# EAGLE design LB_BIT_o16_LIGHTWIRE-v03(rev2) (EAGLE 6.6.0)
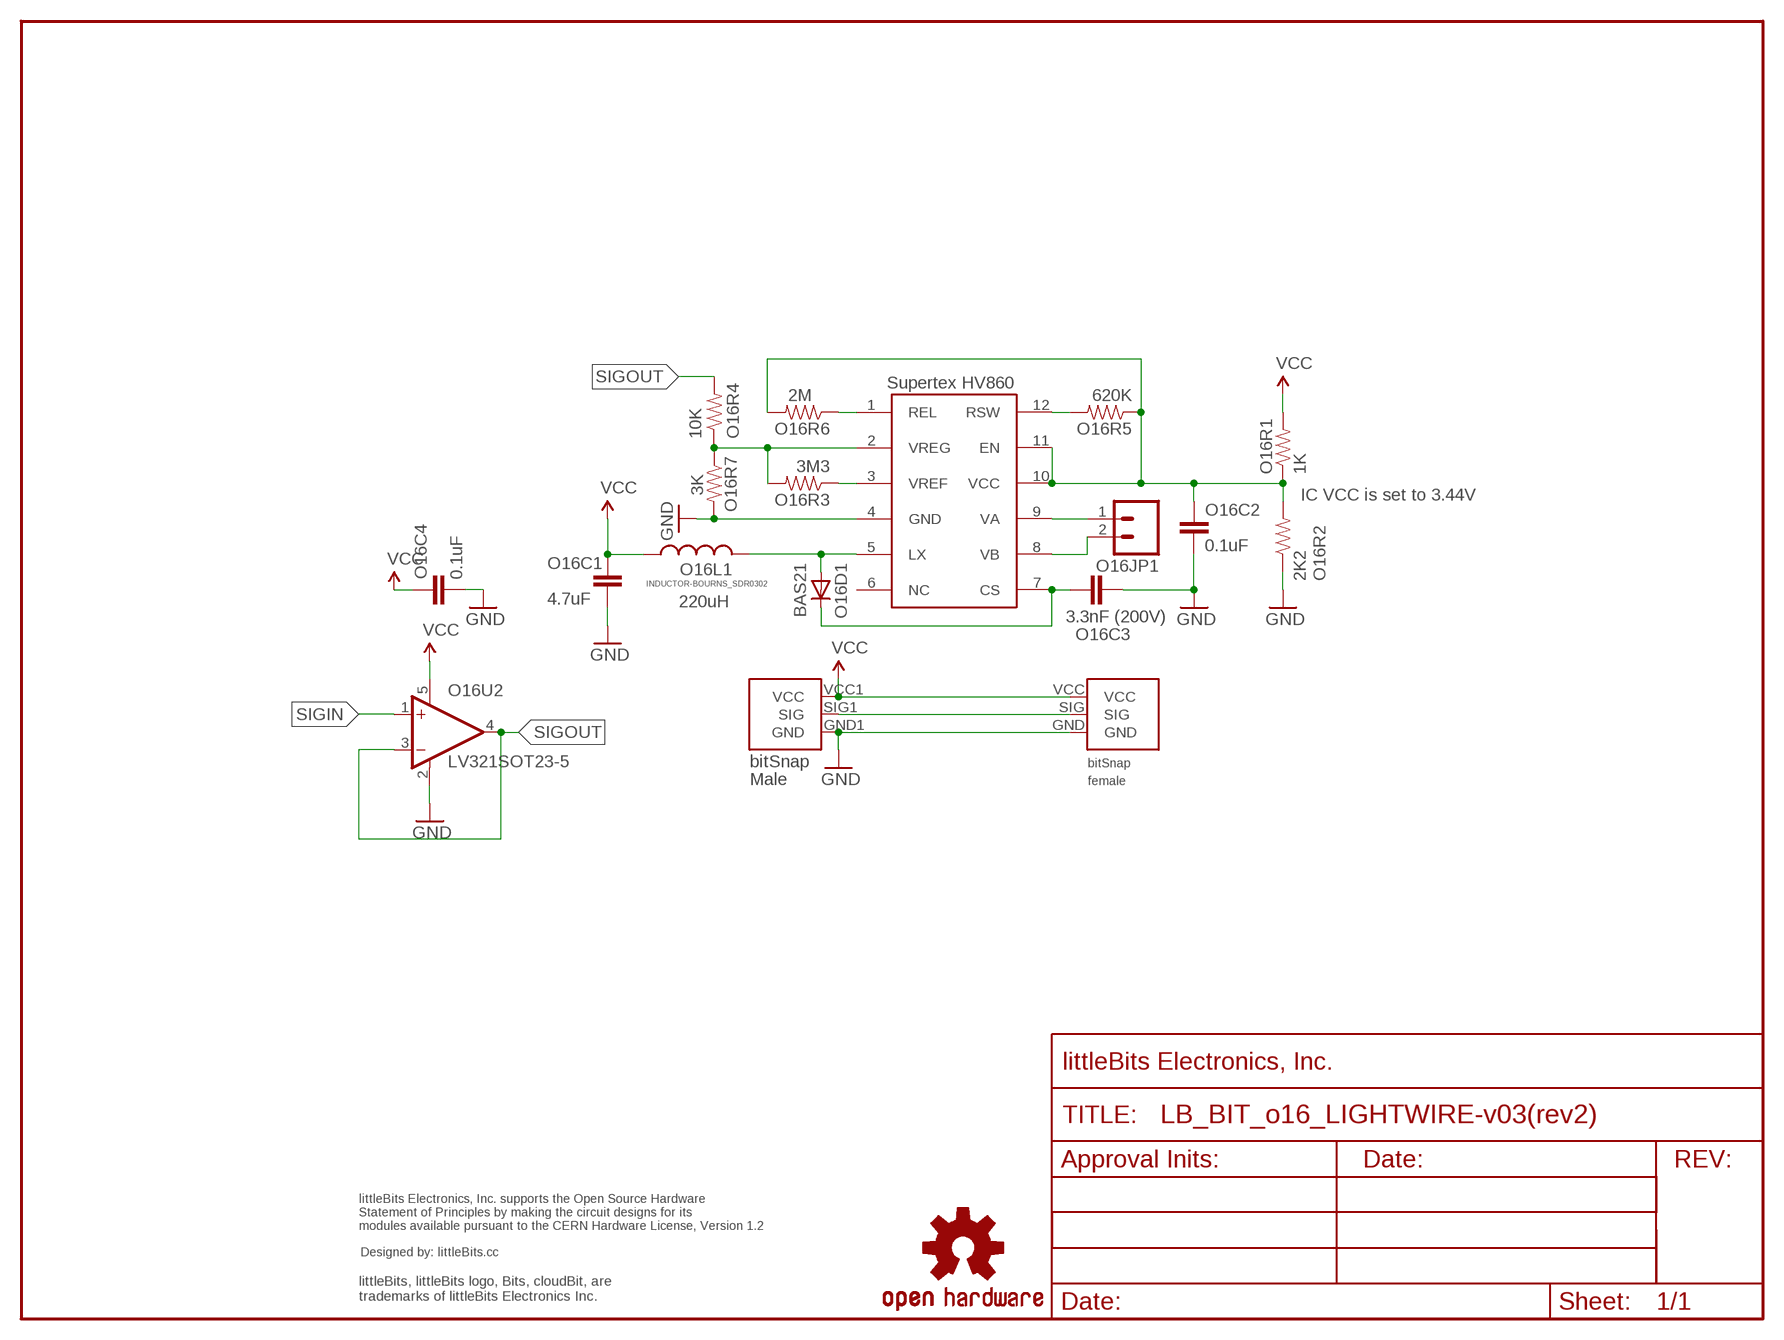
[diagram p0: schematic, sheet 1]

## Parts
O16BSF1  BITSNAP_V03_FEMALE  [BITSNAP_V03_FEMALE]
O16BSM1  BITSNAP_V03_MALE  [BITSNAP_V03_MALE]
O16C1  4.7uF  CAP0603-CAP  [0603-CAP]
O16C2  0.1uF  CAP0603-CAP  [0603-CAP]
O16C3  3.3nF (200V)  CAP0805  [0805]
O16C4  0.1uF  CAP0603-CAP  [0603-CAP]
O16D1  BAS21  DIODESOD  [SOD-323]
O16JP1  M02-JST-2MM-SMT  [S2B-PH]
O16L1  INDUCTOR-BOURNS_SDR0302  [INDUCTOR-BOURNS_SDR0302]
O16R1  1K  RESISTOR0603-RES  [0603-RES]
O16R2  2K2  RESISTOR0603-RES  [0603-RES]
O16R3  3M3  RESISTOR0603-RES  [0603-RES]
O16R4  10K  RESISTOR0603-RES  [0603-RES]
O16R5  620K  RESISTOR0603-RES  [0603-RES]
O16R6  2M  RESISTOR0603-RES  [0603-RES]
O16R7  3K  RESISTOR0603-RES  [0603-RES]
O16U1  SUPERTEX-HV860  [QFN-12(K7)]
O16U2  LV321SOT23-5  [SOT23-5]
U$1  OSHW-LOGOL  [OSHW-LOGO-L]
U$2  OSHWCREDIT  [OSHWCREDIT]
U$5  FRAME-LETTER-OHWOHW  [FABDWG01-OHW]

## Nets
GND: O16BSF1.GND O16BSM1.GND1(GND) O16C1.2 O16C2.2 O16C3.2 O16C4.2 O16R2.1 O16R7.2 O16U1.4(GND) O16U2.2(V-)
N$1: O16JP1.1 O16U1.9(VA)
N$2: O16C3.1 O16D1.1(C) O16U1.7(CS)
N$3: O16JP1.2 O16U1.8(VB)
N$4: O16R3.1 O16U1.3(VREF)
N$7: O16D1.2(A) O16L1.2 O16U1.5(LX)
N$9: O16R6.1 O16U1.1(REL)
N$10: O16R5.2 O16U1.12(RSW)
SIGIN: O16BSF1.SIG O16BSM1.SIG1(SIG) O16U2.1(+IN)
SIGOUT: O16R4.2 O16U2.3(-IN) O16U2.4(OUT)
VCC: O16BSF1.VCC O16BSM1.VCC1(VCC) O16C1.1 O16C4.1 O16L1.1 O16R1.2 O16U2.5(V+)
VIN: O16C2.1 O16R1.1 O16R2.2 O16R5.1 O16R6.2 O16U1.10(VCC) O16U1.11(EN)
VREG: O16R3.2 O16R4.1 O16R7.1 O16U1.2(VREG)
Unconnected: O16U1.6(NC)

## Notes on the sheet
- Supertex HV860
- IC VCC is set to 3.44V
- 220uH

## Library data of the parts
O16BSF1 = bitSnap:BITSNAP_V03_FEMALE
O16BSM1 = bitSnap:BITSNAP_V03_MALE
O16C1-O16C4 = SparkFun:CAP: Capacitor Standard 0603 ceramic capacitor, and 0.1" leaded capacitor.
O16D1 = LITTLEBITS:DIODE: Diode These are standard reverse protection diodes and small signal diodes. SMA package can handle up to about 1A. SOD-323 can handle about 200mA. What the SOD-323 package when ordering, there are some mfgs out there that are 5-pin packages.
O16JP1 = SparkFun:M02: Header 2 Standard 2-pin 0.1" header. Use with straight break away headers (SKU : PRT-00116), right angle break away headers (PRT-00553), swiss pins (PRT-00743), machine pins (PRT-00117), and female headers (PRT-00115). Molex polarized connector foot print use with SKU : PRT-08233 with associated crimp pins and housings.
O16L1 = LITTLEBITS:INDUCTOR-BOURNS_SDR0302; L: 220uH
O16R1-O16R7 = SparkFun:RESISTOR: Resistor Basic schematic elements and footprints for 0603, 1206, and PTH 1/10th watt (small) resistors.
O16U1 = LITTLEBITS:SUPERTEX-HV860
O16U2 = LITTLEBITS:LV321
U$1 = SparkFun_NEW:OSHW-LOGO: Open Source Hardware Logo This logo indicates the piece of hardware it is found on incorporates a OSHW license and/or adheres to the definition of open source hardware found here: http://freedomdefined.org/OSHW
U$2 = LITTLEBITS:OSHWCREDIT
U$5 = LITTLEBITS:FRAME-LETTER-OHW

## Board
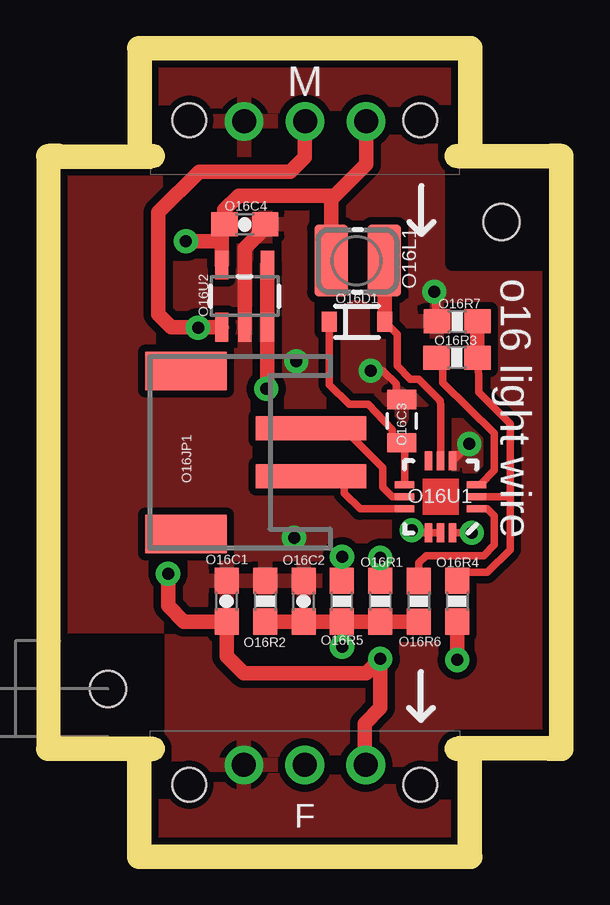
[diagram p1: board, top side]
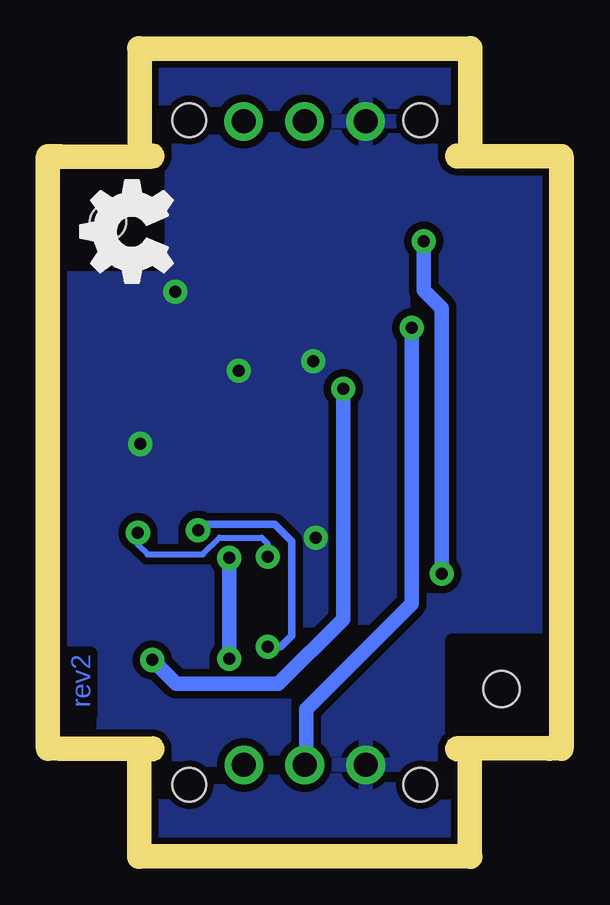
[diagram p2: board, bottom side, seen from below]

Size 20.4 x 32.7 mm. Coordinates in mm from the lower left corner, seen from the top.
Outline: 0,4.5 0,28.2
Outline: 20.4,4.5 20.4,28.2
Copper layers (1*16): Top 0.035mm / dielectric 1.5mm / Bottom 0.035mm
Design rules "default": minimum track width 8mil, minimum drill 0.5mm, track to track 8mil, track to pad 8mil, pad to pad 8mil, via to via 8mil, smd to smd 8mil, copper to edge 10mil, drill to drill 8mil, minimum pad ring 12mil, minimum via ring 10mil, stop-mask expansion 4mil, vias tented up to drill 25mil, thermal gap 10mil
Holes 1.5 mm at 2,6.5 18.4,25.95
tRestrict: area 0,4.5 to 4,8.5; area 16.3,24.2 to 20.4,28.2
bRestrict: area 16.3,24.2 to 20.4,28.2; area 0,4.5 to 4,8.5
Milling: 6 lines

### Footprints (pad centres in the part's own frame; a part is rotated, then mirrored left to right if it is on the bottom)
BITSNAP_V03_FEMALE = drill 1: GND 3.91,3.33; SIG 6.45,3.33; VCC 8.99,3.33 | hole 1.4: 1.63,2.5; 11.27,2.5
BITSNAP_V03_MALE = drill 1: GND1 8.98,2.56; SIG1 6.44,2.56; VCC1 3.9,2.56 | hole 1.4: 11.27,2.5; 1.63,2.5
0603-CAP = smd 1.1 x 1: 1 -0.85,0; 2 0.85,0
0805 = smd 0.8 x 1.2: 1 -0.9,0; 2 0.9,0
SOD-323 = smd 0.63 x 0.83: 1 -1.15,0; 2 1.15,0
S2B-PH = smd 1 x 4.6: 1 -1,-3.7; 2 1,-3.7 | smd 1.6 x 3.4: NC1 -3.4,1.5; NC2 3.4,1.5
INDUCTOR-BOURNS_SDR0302 = smd 3 x 1.4: 1 1.519,2.924; 2 1.519,0.717
0603-RES = smd 1.1 x 1: 1 -0.85,0; 2 0.85,0
QFN-12(K7) = smd 0.8 x 0.3: 1 0,2; 2 0,1.5; 3 0,1; 7 3,1; 8 3,1.5; 9 3,2 | smd 0.3 x 0.8: 4 1,0; 5 1.5,0; 6 2,0; 10 2,3; 11 1.5,3; 12 1,3
SOT23-5 = smd 0.55 x 1.2: 1 -0.95,-1.3; 2 0,-1.3; 3 0.95,-1.3; 4 0.95,1.3; 5 -0.95,1.3

### Placement (x,y rotation side)
O16BSF1  3.75,0 0 top
O16BSM1  16.65,32.7 180 top
O16C1  6.94,10.15 90 top
O16C2  10.15,10.15 90 top
O16C3  14.24,17.65 90 top
O16C4  7.7,25.85 0 top
O16D1  12.38,21.79 0 top
O16JP1  6.75,16.35 90 top
O16L1  14.22,22.83 90 top
O16R1  13.35,10.15 90 top
O16R2  8.56,10.15 270 top
O16R3  16.54,20.3 0 top
O16R4  16.55,10.15 270 top
O16R5  11.75,10.15 90 top
O16R6  14.95,10.14 270 top
O16R7  16.55,21.81 180 top
O16U1  17.36,16 180 top
O16U2  7.69,22.86 0 top
U$1  -17.82,-71.76 0 top  (outside the outline)
U$2  -78.6,-68.15 0 top  (outside the outline)
U$5  13.2,-2.85 0 top
U$6  [OSHW_FILLX150_NOTEXT]  15.72,22.6 0 top

### Tracks (layer width: path | path; a pad name or v marks a point on that pad's centre or on a via)
GND  (via drill 0.5)
  Top 0.305: O16R7.2 v15.6,23.05 | O16U1.4 v17.05,16.7 | v12.95,19.75 13.45,19.75 14,19.2 14,18.56 O16C3.2
  Top 0.61: O16C4.2 8.55,25.7 7.7,24.85 7.7,22.16 O16U2.2
  other vias: 9.85,20.15 9.75,12.8
  pour Bottom (isolate 0.305): 0.33,32.36 20.09,32.36 20.04,0.38 0.33,0.33
  pour Top (isolate 0.305): 0.33,32.36 20.09,32.36 20.04,0.38 0.33,0.33
N$1
  Top 0.305: O16JP1.1 11.85,15.35 11.85,14.65 12.5,14 O16U1.9
N$2
  Top 0.305: O16U1.7 14.35,16.39 O16C3.1 13.85,16.89 13.85,17.3 12.85,18.35 12.05,18.35 11.22,19.17 O16D1.1
N$3
  Top 0.305: O16JP1.2 11.35,17.35 11.7,17 12.15,17 13.45,15.7 13.45,14.9 13.85,14.5 O16U1.8
N$4
  Top 0.305: O16R3.1 15.85,19.95 15.95,19.85 15.95,19.25 18.1,17.15 18.1,15.6 17.5,15 O16U1.3
N$7
  Top 0.305: O16D1.2 14.05,21.26 14.05,19.95 14.6,19.4 14.95,19.4 15.85,18.5 15.85,18.29 O16U1.5
  Top 0.61: O16D1.2 13.52,24.13 O16L1.2
N$9
  Top 0.305: O16R6.1 14.95,11.75 15.25,12.05 17.65,12.05 18.1,12.5 18.1,13.7 17.8,13.99 O16U1.1
N$10  (via drill 0.5)
  Top 0.305: O16U1.12 v17.15,13 | v11.75,12 O16R5.2
  Bottom 0.254: v17.15,13 17.15,12.5 16.75,12.1 14.45,12.1 13.75,12.8 12,12.8 11.75,12.55 v11.75,12
SIGIN  (via drill 0.5)
  Top 0.61: O16BSM1.SIG1 10.2,29.88 10.2,28.65 9.6,28.05 5.8,28.05 4.1,26.35 4.1,22.1 4.64,21.56 O16U2.1 6.64,21.55 v5.75,21.55
  Bottom 0.61: v5.75,21.55 5.75,10.05 10.15,5.65 10.15,3.38 O16BSF1.SIG
SIGOUT  (via drill 0.5)
  Top 0.61: O16U2.4 O16U2.3 8.64,19.04 v8.6,19 | v16.55,7.7 O16R4.2
  Bottom 0.61: v8.6,19 8.6,9.4 11.3,6.7 15.55,6.7 v16.55,7.7
VCC  (via drill 0.5)
  Top 0.406: O16R1.2 v13.35,11.95
  Top 0.61: O16U2.5 6.74,25.39 O16C4.1 | O16BSM1.VCC1 12.75,28.35 11.3,26.9 | 11.3,26.9 11.3,24.15 O16L1.1 11.3,26.85 11.3,27.05 | O16C4.1 6.7,25.15 v5.25,25.15 | 11.3,27.05 11.3,26.9 | O16BSF1.VCC 12.7,3.37 12.7,5.05 13.35,5.7 v13.35,7.75 12.75,7.15 7.65,7.15 6.95,7.85 6.95,9.44 O16C1.1 5.15,9.3 4.5,9.95 v4.5,11.3 | 11.3,27.05 7.45,27.05 6.85,26.45 O16C4.1
  Bottom 0.61: v13.35,11.95 v13.35,7.75 | v5.25,25.15 5.25,23.1 4.5,22.35 v4.5,11.3
VIN  (via drill 0.5)
  Top 0.305: v11.75,8.25 11.75,9.6 O16R5.1 | v14.65,13.1 14.6,13 O16U1.10 O16U1.11
  Top 0.61: O16R6.2 O16R1.1 O16R5.1 10.06,9.3 O16C2.1 O16R2.2
  Bottom 0.305: v11.75,8.25 11.2,8.25 10.75,8.7 10.75,12.65 11.45,13.35 14.4,13.35 v14.65,13.1
VREG
  Top 0.305: O16R3.2 17.45,19.54 17.45,18.85 18.75,17.55 18.75,14.5 | O16R4.1 16.65,11.35 17.8,11.35 18.75,12.3 18.75,14.5 | 18.75,14.5 O16U1.2
  Top 0.61: O16R3.2 O16R7.1

### Text on the board
Bottom: rev2
tPlace: o16 light wire
Milling: 1mm DIA. ROUTER PATH
dxf: 2 | o16 LIGHT WIRE BIT PCB